# Altium schematic sheet DigitalIO.SchDoc
size A4; SheetNumber: 8; SheetTotal: 14
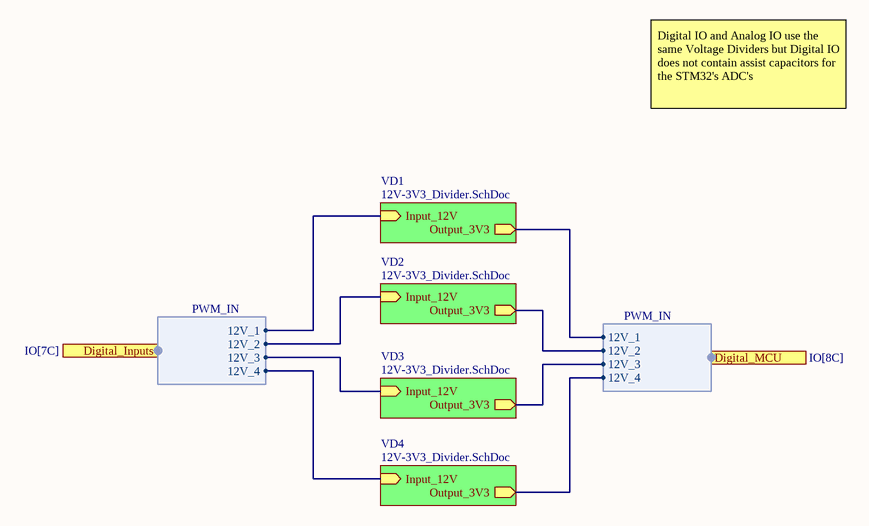
[diagram p0: DigitalIO.SchDoc]

## Sub-sheets
VD1 = 12V-3V3_Divider.SchDoc: Input_12V (in), Output_3V3 (out)
VD2 = 12V-3V3_Divider.SchDoc: Input_12V (in), Output_3V3 (out)
VD3 = 12V-3V3_Divider.SchDoc: Input_12V (in), Output_3V3 (out)
VD4 = 12V-3V3_Divider.SchDoc: Input_12V (in), Output_3V3 (out)

## Ports
Digital_Inputs (harness PWM_IN, see IO[7C]), Digital_MCU (harness PWM_IN, see IO[8C])

## Harnesses
PWM_IN: 12V_1, 12V_2, 12V_3, 12V_4

## Nets
(unnamed): sheet VD1/Input_12V, port Digital_Inputs.12V_1
(unnamed): sheet VD1/Output_3V3, port Digital_MCU.12V_1
(unnamed): sheet VD2/Input_12V, port Digital_Inputs.12V_2
(unnamed): sheet VD2/Output_3V3, port Digital_MCU.12V_2
(unnamed): sheet VD3/Input_12V, port Digital_Inputs.12V_3
(unnamed): sheet VD3/Output_3V3, port Digital_MCU.12V_3
(unnamed): sheet VD4/Input_12V, port Digital_Inputs.12V_4
(unnamed): sheet VD4/Output_3V3, port Digital_MCU.12V_4

## Notes on the sheet
- Digital IO and Analog IO use the same Voltage Dividers but Digital IO does not contain assist capacitors for the STM32's ADC's